# Altium schematic sheet IRGenerator.SchDoc
size A4
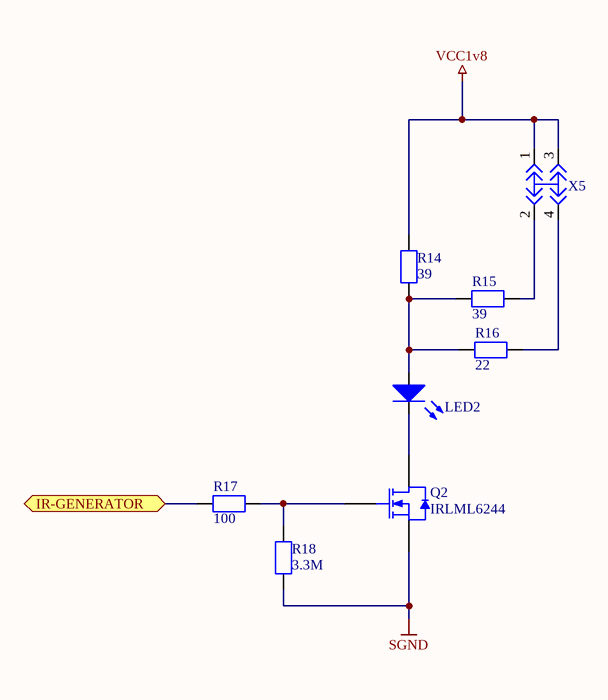
[diagram p0: IRGenerator.SchDoc]

## Parts
LED2  L53F3C  [LED-5-SHORT-LEGS]  (value not drawn)
Q2  IRLML6244  [SOT23_N]
R14  value 39  [R1206]  (hidden comment: R39-5%)
R15  value 39  [R1206]  (hidden comment: R39-5%)
R16  value 22  [R0805]  (hidden comment: R22-5%)
R17  value 100  [R0805]  (hidden comment: R100-5%)
R18  value 3.3M  [R0805]  (hidden comment: R3.3M-5%)
X5  JUMPER-PLD-POWER-0-1-2  [PLD-POWER-0-1-2]  (value not drawn)

## Ports
IR-GENERATOR

## Nets
SGND: Q2.2(S) R18.2
VCC1v8: R14.2 X5.1 X5.3
IR-GENERATOR: R17.1 ; port IR-GENERATOR
NetLED2_1: LED2.1(A) R14.1 R15.2 R16.1
NetLED2_2: LED2.2(K) Q2.3(D)
NetQ2_1: Q2.1(G) R17.2 R18.1
NetR15_1: R15.1 X5.2
NetR16_2: R16.2 X5.4

## Library data of the parts
LED2 = L53F3C: IR LED; Type: Светодиод; Color: IR; Name: L53F3C
Q2 = IRLML6244: N-Channel Power MOSFET; Type: MOSFET N-канал; Id: 6.3A; Vgs: 0.5-11V; Vds: 20V; Name: IRLML6244
R14 R15 = R39-5%: Precision: 5%; Type: Резистор; Name: R39-5%
R16 = R22-5%: Precision: 5%; Type: Резистор; Name: R22-5%
R17 = R100-5%: R-100-5%; Precision: 5%; Type: Резистор; Name: R100-5%
R18 = R3.3M-5%: Precision: 5%; Type: Резистор; Name: R3.3M-5%
X5 = JUMPER-PLD-POWER-0-1-2: Name: JUMPER-PLD-POWER-0-1-2; Type: Линейка джамперов